# EAGLE design Escorna_CPU_2_40Amt (EAGLE 6.5.0)
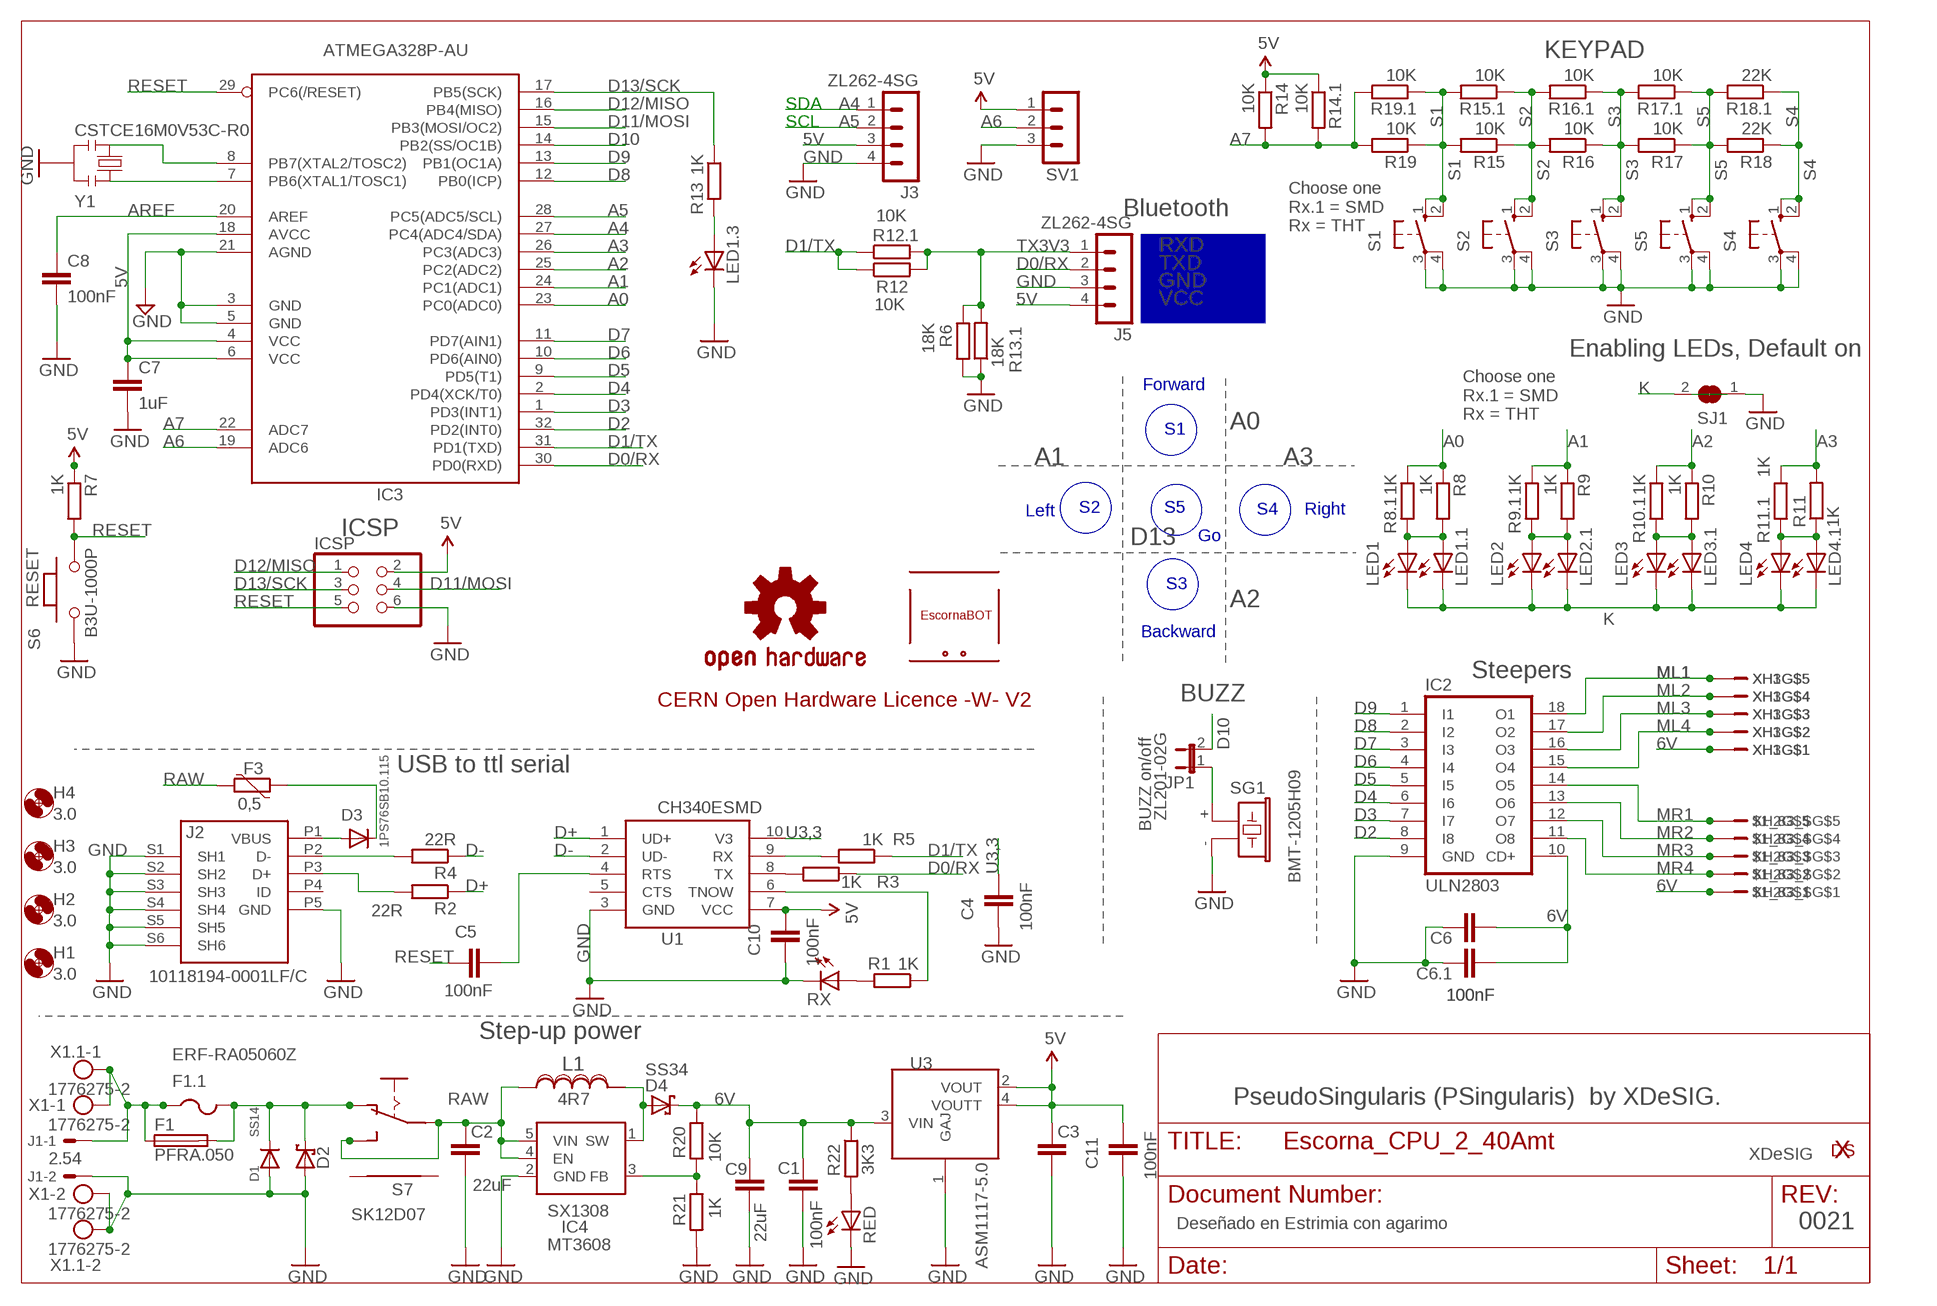
[diagram p0: schematic, sheet 1]

## Parts
$1_82_$  XDESIG_XDESIG21  [XDESIG_XDESIG]
$1_83_$  B5B-XH-A  [B5B-XH-A]
C1  100nF  0015_100NF_0603  [C0603-ROUND]
C2  22uF  C-EUC1206K  [C1206K]
C3  10uF  C-EUC1206K  [C1206K]
C4  100nF  0015_100NF_0603  [C0603-ROUND]
C5  100nF  0015_100NF_0603  [C0603-ROUND]
C6  100nF  C-EU025-024X044  [C025-024X044]
C6.1  100nF  C-EUC0603K  [C0603K]
C7  1uF  0006_1UF_0603/GRM188R61E105KA12D  [C0603-ROUND]
C8  100nF  0015_100NF_0603  [C0603-ROUND]
C9  22uF  C-EUC1206K  [C1206K]
C10  100nF  0015_100NF_0603  [C0603-ROUND]
C11  100nF  0015_100NF_0603  [C0603-ROUND]
D1  SS14  DIODESMA  [SMADIODE]
D2  1N5817  P4KEXX  [DO41-10]
D3  1PS76SB10.115  DIODESOD-323F  [SOD-323F]
D4  SS34  DIODE_SCHOTTKY-DIODESMA  [DIODE_SMA]
ESC  ESCORNABOT  [ESCORNA_PEQUE]
F1  PFRA.050  FUSETE5  [TE5]
F1.1  ERF-RA05060Z  PTCFUSE-1206  [R1206]
F3  0,5  PTC1206L  [R1206]
H1  3.0  MOUNT-HOLE3.0  [3,0]
H2  3.0  MOUNT-HOLE3.0  [3,0]
H3  3.0  MOUNT-HOLE3.0  [3,0]
H4  3.0  MOUNT-HOLE3.0  [3,0]
IC2  ULN2803  ULN2803A  [DIL18]
IC3  ATMEGA328P-AU  0265_ATMEGA328P-AU  [TQFP32-08]
IC4  SX1308  [SOT23-6]
ICSP  0114_PH254-203DF118A00V  [2X03]
J1  2.54  22-27-2021-02  [6410-02]
J2  10118194-0001LF/C  SMARTPRJ_MYCON2_USB-MINI-B  [SMARTPRJ_CON2_USB_MICRO_B_AT]
J3  ZL262-4SG  MA04-1  [MA04-1]
J5  ZL262-4SG  MA04-1  [MA04-1]
JP1  ZL201-02G  JP1E  [JP1]
L1  4R7  SRN6045-330M6045  [SRN6045]
LED1  LED3MM  [LED3MM]
LED1.1  LEDCHIPLED_0603  [CHIPLED_0603]
LED1.3  LEDCHIPLED_0603  [CHIPLED_0603]
LED2  LED3MM  [LED3MM]
LED2.1  LEDCHIPLED_0603  [CHIPLED_0603]
LED3  LED3MM  [LED3MM]
LED3.1  LEDCHIPLED_0603  [CHIPLED_0603]
LED4  LED3MM  [LED3MM]
LED4.1  LEDCHIPLED_0603  [CHIPLED_0603]
LOGO2  OSHW-LOGOL  [ESCORNA_LBRESCORNA_CPU_2_10_SPARKFUN-AESTHETICS_OSHW-LOGO-L]
R1  1K  R-EU_R0603  [R0603]
R2  22R  R-EU_R0603  [R0603]
R3  1K  R-EU_R0603  [R0603]
R4  22R  R-EU_R0603  [R0603]
R5  1K  R-EU_R0603  [R0603]
R6  18K  R-EU_0204/7  [0204/7]
R7  1K  R-EU_R0603  [R0603]
R8  1K  R-EU_0204/7  [0204/7]
R8.1  1K  R-EU_R0603  [R0603]
R9  1K  R-EU_0204/7  [0204/7]
R9.1  1K  R-EU_R0603  [R0603]
R10  1K  R-EU_0204/7  [0204/7]
R10.1  1K  R-EU_R0603  [R0603]
R11  1K  R-EU_0204/7  [0204/7]
R11.1  1K  R-EU_R0603  [R0603]
R12  10K  R-EU_0204/7  [0204/7]
R12.1  10K  R-EU_R0603  [R0603]
R13  1K  R-EU_R0603  [R0603]
R13.1  18K  R-EU_R0603  [R0603]
R14  10K  R-EU_0204/7  [0204/7]
R14.1  10K  R-EU_R0603  [R0603]
R15  10K  R-EU_0204/7  [0204/7]
R15.1  10K  R-EU_R0603  [R0603]
R16  10K  R-EU_0204/7  [0204/7]
R16.1  10K  R-EU_R0603  [R0603]
R17  10K  R-EU_0204/7  [0204/7]
R17.1  10K  R-EU_R0603  [R0603]
R18  22K  R-EU_0204/7  [0204/7]
R18.1  22K  R-EU_R0603  [R0603]
R19  10K  R-EU_0204/7  [0204/7]
R19.1  10K  R-EU_R0603  [R0603]
R20  10K  R-EU_R0603  [R0603]
R21  1K  R-EU_R0603  [R0603]
R22  3K3  R-EU_R0603  [R0603]
RED  LEDCHIPLED_0603  [CHIPLED_0603]
RX  LEDCHIPLED_0603  [CHIPLED_0603]
S1  40-XX  [B3F-40]
S2  40-XX  [B3F-40]
S3  40-XX  [B3F-40]
S4  40-XX  [B3F-40]
S5  40-XX  [B3F-40]
S6  B3U-1000P  0173_IT-1185AP1C-160G-G_T&R  [SMD_157SW]
S7  SK12D07  ESCORNA_SK12F14D  [ESCORNA_SK-12D07]
SG1  BMT-1205H09  F/CM12P  [F/CM12P]
SJ1  SJ  [SJ]
SV1  MA03-1  [MA03-1]
U1  CH340ESMD  [MSOP10]
U3  ASM1117-5.0  ASM1117-3.3  [SOT223]
X1  1776275-2  AK550/2  [AK550/2]
X1.1  1776275-2  AK550/2  [AK550/2]
XH1  B5B-XH-A  [B5B-XH-A]
XH2  B5B-XH-A  [B5B-XH-A]
XH3  B5B-XH-A  [B5B-XH-A]
Y1  CSTCE16M0V53C-R0  0011_CSTCE16M0V53-R0  [RESONATOR]

## Nets
5V: C3.2 C7.1 C10.2 C11.2 IC3.4(VCC) IC3.6(VCC) IC3.18(AVCC) ICSP.2 J3.3 J5.4 R7.1 R14.1 R14.1.1 SV1.1 U1.7(VCC) U3.2(VOUT) U3.4(VOUTT)
6V: $1_83_$.P$1 C1.2 C6.1.2 C6.2 C9.2 D4.C IC2.10(CD+) R20.1 R22.1 U3.3(VIN) XH1.P$1 XH2.P$1 XH3.P$1
+D: J2.P3(D+) R2.2
-D: J2.P2(D-) R4.2
A0: IC3.23(PC0(ADC0)) R8.1 R8.1.1
A1: IC3.24(PC1(ADC1)) R9.1 R9.1.1
A2: IC3.25(PC2(ADC2)) R10.1 R10.1.1
A3: IC3.26(PC3(ADC3)) R11.1.1 R11.2
A4: IC3.27(PC4(ADC4/SDA)) J3.1
A5: IC3.28(PC5(ADC5/SCL)) J3.2
A6: IC3.19(ADC6) SV1.2
A7: IC3.22(ADC7) R14.1.2 R14.2 R19.1.2 R19.2
AREF [aref]: C8.1 IC3.20(AREF)
D0/RX: IC3.30(PD0(RXD)) J5.2 R3.1
D1/TX: IC3.31(PD1(TXD)) R5.1 R12.1 R12.1.1
D2: IC2.8(I8) IC3.32(PD2(INT0))
D3: IC2.7(I7) IC3.1(PD3(INT1))
D4: IC2.6(I6) IC3.2(PD4(XCK/T0))
D5: IC2.5(I5) IC3.9(PD5(T1))
D6: IC2.4(I4) IC3.10(PD6(AIN0))
D7: IC2.3(I3) IC3.11(PD7(AIN1))
D8: IC2.2(I2) IC3.12(PB0(ICP))
D9: IC2.1(I1) IC3.13(PB1(OC1A))
D10: IC3.14(PB2(SS/OC1B)) JP1.2
D11/MOSI: IC3.15(PB3(MOSI/OC2)) ICSP.4
D12/MISO: IC3.16(PB4(MISO)) ICSP.1
D13/SCK: IC3.17(PB5(SCK)) ICSP.3 R13.1
D+: R2.1 U1.1(UD+)
D-: R4.1 U1.2(UD-)
DTR?: C5.2 U1.4(RTS)
GND: C1.1 C2.1 C3.1 C4.1 C6.1 C6.1.1 C7.2 C8.2 C9.1 C10.1 C11.1 D1.A D2.A IC2.9(GND) IC3.3(GND) IC3.5(GND) IC3.21(AGND) IC4.2(GND) ICSP.6 J1.2 J2.P5(GND) J2.S1(SH1) J2.S2(SH2) J2.S3(SH3) J2.S4(SH4) J2.S5(SH5) J2.S6(SH6) J3.4 J5.3 LED1.3.C R6.2 R13.1.1 R21.2 RED.C RX.C S1.3(P) S1.4(P1) S2.3(P) S2.4(P1) S3.3(P) S3.4(P1) S4.3(P) S4.4(P1) S5.3(P) S5.4(P1) S6.1 SG1.- SJ1.1 SV1.3 U1.3(GND) U3.1(GAJ) X1.1.2 X1.2 Y1.2
K: LED1.1.C LED1.K(C) LED2.1.C LED2.K(C) LED3.1.C LED3.K(C) LED4.1.C LED4.K(C) SJ1.2
ML1: IC2.18(O1) XH1.P$5 XH3.P$5
ML2: IC2.17(O2) XH1.P$4 XH3.P$4
ML3: IC2.16(O3) XH1.P$3 XH3.P$3
ML4: IC2.15(O4) XH1.P$2 XH3.P$2
MR1: $1_83_$.P$5 IC2.14(O5) XH2.P$5
MR2: $1_83_$.P$4 IC2.13(O6) XH2.P$4
MR3: $1_83_$.P$3 IC2.12(O7) XH2.P$3
MR4: $1_83_$.P$2 IC2.11(O8) XH2.P$2
N$2: JP1.1 SG1.+
N$3: D1.C D2.C F1.1.2 F1.2 S7.P$2(O)
N$4: LED2.1.A LED2.A R9.1.2 R9.2
N$5: LED1.1.A LED1.A R8.1.2 R8.2
N$6: LED3.1.A LED3.A R10.1.2 R10.2
N$8: LED4.1.A LED4.A R11.1 R11.1.2
N$10: D3.A J2.P1(VBUS)
N$12: F1.1 F1.1.1 J1.1 X1.1 X1.1.1
N$15: R1.2 RX.A
N$16: IC4.3(FB) R20.2 R21.1
N$17: IC3.7(PB6(XTAL1/TOSC1)) Y1.1
N$18: IC3.8(PB7(XTAL2/TOSC2)) Y1.3
N$19: LED1.3.A R13.2
N$20: D4.A IC4.1(SW) L1.1
N$21: D3.C F3.1
N$22: R22.2 RED.A
N$23: R5.2 U1.9(RX)
N$24: R3.2 U1.8(TX)
N$25: R1.1 U1.6(TNOW)
RAW: C2.2 F3.2 IC4.4(EN) IC4.5(VIN) L1.2 S7.P$1(P) S7.P$3(S)
RESET: C5.1 IC3.29(PC6(/RESET)) ICSP.5 R7.2 S6.2
S1: R15.1.2 R15.2 R19.1 R19.1.1 S1.1(S) S1.2(S1)
S2: R15.1 R15.1.1 R16.1.2 R16.2 S2.1(S) S2.2(S1)
S3: R16.1 R16.1.1 R17.1.2 R17.2 S3.1(S) S3.2(S1)
S4: R18.1 R18.1.1 S4.1(S) S4.2(S1)
S5: R17.1 R17.1.1 R18.1.2 R18.2 S5.1(S) S5.2(S1)
TX3V3: J5.1 R6.1 R12.1.2 R12.2 R13.1.2
U3,3: C4.2 U1.10(V3)
Unconnected: J2.P4(ID) S7.P$4 S7.P$5 U1.5(CTS)

## Notes on the sheet
- KEYPAD
- SDA
- SCL
- Bluetooth
- Choose one
  Rx.1 = SMD
  Rx = THT
- RXD
- TXD
- GND
- VCC
- Enabling LEDs, Default on
- Forward
- A0
- S1
- Choose one
  Rx.1 = SMD
  Rx = THT
- A1 | A3
- Left | S2 | S5 | S4 | Right
- ICSP
- D13 | Go
- S3
- RESET | A2
- Backward
- BUZZ | Steepers
- CERN Open Hardware Licence -W- V2
- BUZZ on/off
- USB to ttl serial
- Step-up power
- PseudoSingularis (PSingularis)  by XDeSIG.
- XDeSIG
- SX1308
- IC4 | Deseñado en Estrimia con agarimo | 0021
- MT3608

## Library data of the parts
$1_82_$ = Escorna_CPU_2_01:XDESIG_XDESIG
$1_83_$ XH1-XH3 = con-jst:B5B-XH-A
C1 C4 C5 C8 C10 C11 = Condensatori:0015_100NF_0603: 100nF 0603 50V; CASE: 0603; MONTHLY_USAGE: _____; PART_NUMBER: cl10b104kbnc; PRICE: _____; SUPPLIER: _____; TYPE: Condensatori
C2 C3 C6 C6.1 C9 = rcl:C-EU: CAPACITOR, European symbol
C7 = Condensatori:0006_1UF_0603/GRM188R61E105KA12D: 1uF 0603; CASE: 0603; MONTHLY_USAGE: _____; PART_NUMBER: 1uF_0603/GRM188R61E105KA12D; PRICE: _____; SUPPLIER: _____; TYPE: Condensatori
D1 D3 = adafruit:DIODE: Diode SMADIODE - SMA Surface Mount Package 20V 1A Schottky Diode Digikey: 641-1014-6-ND DO-1N4148 - Through Hole Small Current Diode SOD-123 20V 1 A (.5mV Vf) Schottky Diode - Digikey: MBRX120TPMSCT-ND SOD-323 10V 570mA (.38mV Vf, 3ns) Schottky Diode - Digikey: ZLLS410CT-ND SOD-523 30V 30mA Schottky Diode (RB751S-40TE61) - Digikey: RB751S-40TE61CT-ND SOT23-R/W - SOT23 Package (R = Solder Paste/Reflow Ovens, W = Hand-Soldering) BAT54Film 40V 300mA - Digikey: 497-7162-1-ND
D2 = diode:P4KEXX: DIODE transient-voltage suppressor
D4 = cervus2.100:DIODE_SCHOTTKY-DIODE: Schottky Diode
ESC = escorna:ESCORNABOT
F1 = fuse:FUSE: Fuse; OC_FARNELL: unknown; OC_NEWARK: unknown
F1.1 = adafruit:PTCFUSE: PTC fuses, resettable thermistors
F3 = Arduino-rcl:PTC: SMD PTC
H1-H4 = holes:MOUNT-HOLE: MOUNTING HOLE with drill center marker
IC2 = uln-udn:ULN2803A: DRIVER ARRAY
IC3 = IntegratedCircuits:0265_ATMEGA328P-AU: 8-bit Microcontroller with 32KBytes In-System Programmable Flash ATMEGA328P-AU; CASE: TQFP32_7x7; MONTHLY_USAGE: _____; PART_NUMBER: ATMEGA328P-AU; PRICE: _____; SUPPLIER: _____; TYPE: Circuito_Integrato
IC4 = SX1308:SX1308
ICSP = Connettori:0114_PH254-203DF118A00V: 3x2 M V h 8,5 mm p2,54; MONTHLY_USAGE: _____; PART_NUMBER: PH254-203DF118A00V; PRICE: _____; SUPPLIER: _____; TYPE: Connettori; VALUE: ICSP
J1 = con-molex:22-?-02: CONNECTOR wire to board 2.54 mm (.1 inch) pitch header; OC_FARNELL: unknown; OC_NEWARK: unknown
J2 = cervus2.100:SMARTPRJ_MYCON2_USB-MINI-B
J3 J5 = con-lstb:MA04-1: PIN HEADER; OC_FARNELL: unknown; OC_NEWARK: unknown
JP1 = jumper:JP1E: JUMPER
L1 = SRN6045-330M:SRN6045-330M: Fixed Inductors SMD; AVAILABILITY: Unavailable; DESCRIPTION: 33µH Semi-Shielded Wirewound Inductor 1.4A 188mOhm Max Nonstandard; MF: Bourns; MP: SRN6045-330M; PACKAGE: Nonstandard Bourns; PRICE: None
LED1 LED1.1 LED1.3 LED2 LED2.1 LED3 LED3.1 LED4 LED4.1 RED RX = adafruit:LED: LED OSRAM: - CHIPLED LG R971, LG N971, LY N971, LG Q971, LY Q971, LO R971, LY R971 LH N974, LH R974 LS Q976, LO Q976, LY Q976 LO Q996 - Hyper CHIPLED LW Q18S LB Q993, LB Q99A, LB R99A - SideLED LS A670, LO A670, LY A670, LG A670, LP A670 LB A673, LV A673, LT A673, LW A673 LH A674 LY A675 LS A676, LA A676, LO A676, LY A676, LW A676 LS A679, LY A679, LG A679 - Hyper Micro SIDELED® LS Y876, LA Y876, LO Y876, LY Y876 LT Y87S - SmartLED LW L88C, LW L88S LB L89C, LB L89S, LG L890 LS L89K, LO L89K, LY L89K LS L896, LA L896, LO L896, LY L896 - TOPLED LS T670, LO T670, LY T670, LG T670, LP T670 LSG T670, LSP T670, LSY T670, LOP T670, LYG T670 LG T671, LOG T671, LSG T671 LB T673, LV T673, LT T673, LW T673 LH T674 LS T676, LA T676, LO T676, LY T676, LB T676, LH T676, LSB T676, LW T676 LB T67C, LV T67C, LT T67C, LS T67K, LO T67K, LY T67K, LW E67C LS E67B, LA E67B, LO E67B, LY E67B, LB E67C, LV E67C, LT E67C LW T67C LS T679, LY T679, LG T679 LS T770, LO T770, LY T770, LG T770, LP T770 LB T773, LV T773, LT T773, LW T773 LH T774 LS E675, LA E675, LY E675, LS T675 LS T776, LA T776, LO T776, LY T776, LB T776 LHGB T686 LT T68C, LB T68C - Hyper Mini TOPLED® LB M676 - Mini TOPLED Santana® LG M470 LS M47K, LO M47K, LY M47K Source: http://www.osram.convergy.de/
LOGO2 = Echidna_shield_LBR:OSHW-LOGO: Open Source Hardware Logo This logo indicates the piece of hardware it is found on incorporates a OSHW license and/or adheres to the definition of open source hardware found here: http://freedomdefined.org/OSHW
R1-R8 R8.1 R9 R9.1 R10 R10.1 R11 R11.1 R12 R12.1 R13 R13.1 R14 R14.1 R15 R15.1 R16 R16.1 R17 R17.1 R18 R18.1 R19 R19.1 R20-R22 = rcl:R-EU_: RESISTOR, European symbol
S1-S5 = switch-omron:40-XX: OMRON SWITCH; MF: OMRON COMPONENTS USA; MPN: B3F-4000; OC_FARNELL: 176434; OC_NEWARK: 36K3105
S6 = Switches:0173_IT-1185AP1C-160G-G_T&R: Pushbutton 4x3 SMD H2,5mm; MONTHLY_USAGE: _____; PART_NUMBER: IT-1185AP1C-160G-G_T&R; PRICE: _____; SUPPLIER: _____; TYPE: Switches; VALUE: 157SW
S7 = escorna_ELIB:ESCORNA_SK12F14
SG1 = buzzer:F/CM12P: BUZZER Source: Buerklin; OC_FARNELL: unknown; OC_NEWARK: unknown
SJ1 = jumper:SJ: SMD solder JUMPER
SV1 = con-lstb:MA03-1: PIN HEADER; OC_FARNELL: unknown; OC_NEWARK: unknown
U1 = CH340E:CH340E: WCH.CN/CH340E See DataSheet： wch.cn <http://www.wch.cn/downloads/CH340DS1_PDF.html>; AVAILABILITY: Unavailable; DESCRIPTION: USB to serial chip CH340; MF: WCH; MP: CH340E; PACKAGE: Package Analog Devices; PRICE: None
U3 = Itead_IC_110429:ASM1117-3.3: ICP006
X1 X1.1 = con-ptr500:AK550/2: CONNECTOR; OC_FARNELL: unknown; OC_NEWARK: unknown
Y1 = Cristalli:0011_CSTCE16M0V53-R0: 16Mhz - SMD; MONTHLY_USAGE: _____; PART_NUMBER: CSTCE16M0V53-R0; PRICE: _____; SUPPLIER: _____; TYPE: Cristalli; VALUE: CSTCE16M0V53-R0

## Net classes
0 default: width 0.254 mm, drill 0.61 mm, clearance 0.254 mm
1 power: width 0.254 mm, drill 0.61 mm, clearance 0.254 mm
4 aref: width 0.254 mm, drill 0.61 mm, clearance 0.254 mm

## Board
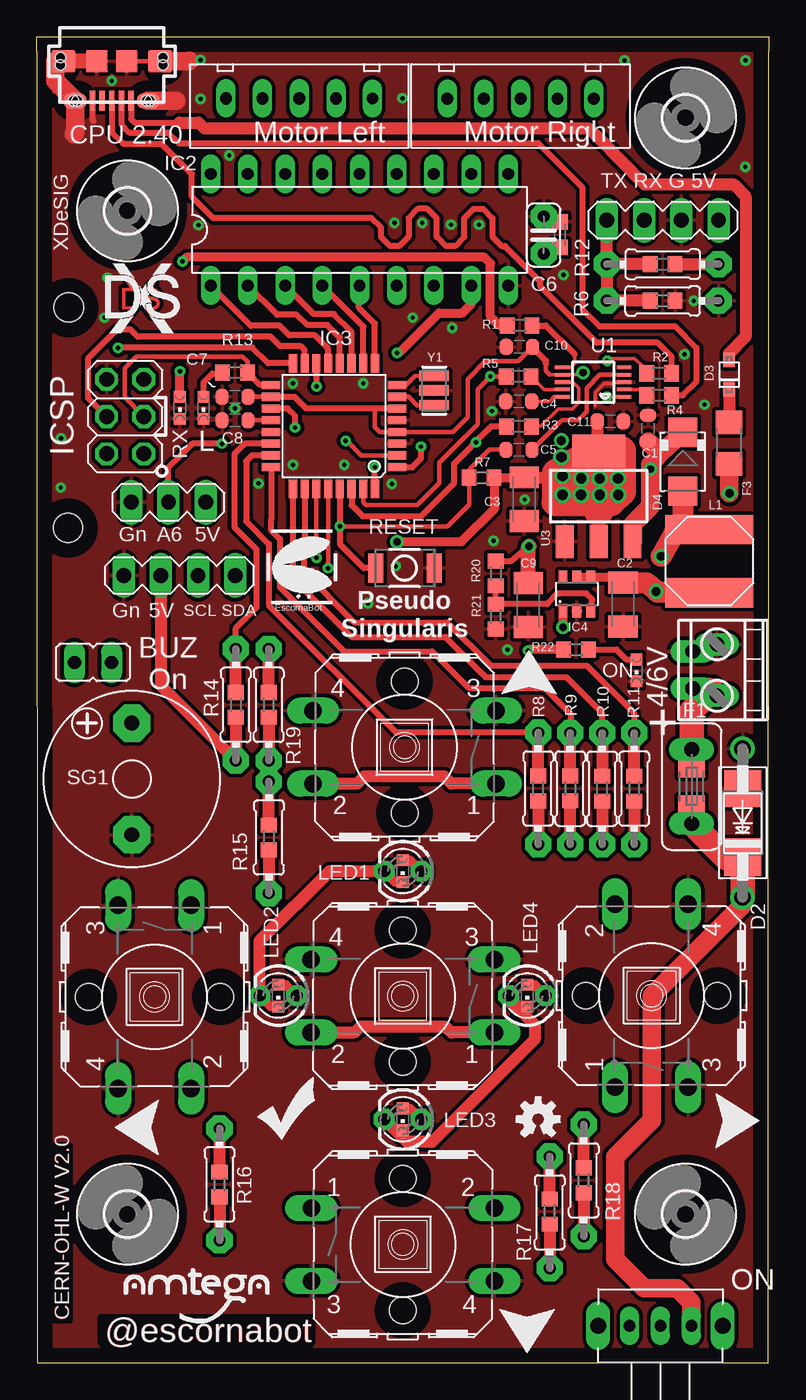
[diagram p1: board, top side]
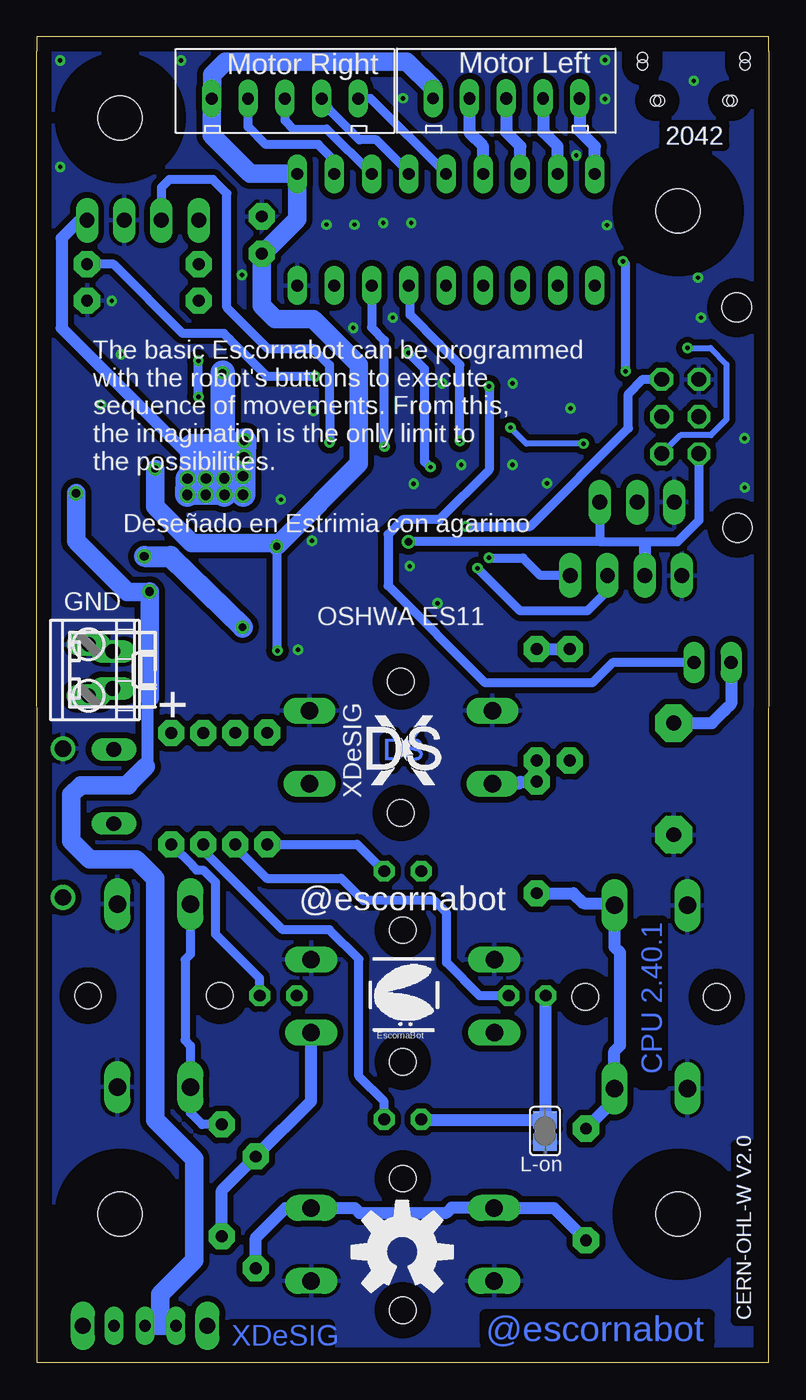
[diagram p2: board, bottom side, seen from below]

Size 49.99 x 90.58 mm. Coordinates in mm from the lower left corner, seen from the top.
Outline: 49.99,89.59 49.95,0 0.05,0 0,89.59
Outline: 0,89.58 0,89.59
Outline: 0,89.59 0,90.58 49.99,90.57 49.99,89.59
Copper layers (1*16): Top 0.035mm / dielectric 1.5mm / Bottom 0.035mm
Design rules "PCBway": minimum track width 6mil, minimum drill 0.3mm, track to track 0.205mm, track to pad 0.205mm, pad to pad 0.205mm, via to via 0.205mm, smd to smd 8mil, copper to edge 40mil, drill to drill 8mil, minimum pad ring 10mil, minimum via ring 8mil, stop-mask expansion 4mil, vias tented up to drill 25mil, thermal gap 10mil
Holes 2 mm at 2.15,57.03 2.2,72.08

### Footprints (pad centres in the part's own frame; a part is rotated, then mirrored left to right if it is on the bottom)
B5B-XH-A = drill 0.8 long: P$1 -5.17,-0.19; P$2 -2.69,-0.175; P$3 -0.175,-0.175; P$4 2.34,-0.175; P$5 4.83,-0.175
C0603-ROUND = smd 0.898 x 1.1: 1 -0.889,0; 2 0.889,0
C1206K = smd 1.5 x 2: 1 -1.5,0; 2 1.5,0
C025-024X044 = drill 0.813 pad 1.778 octagon: 1 -1.27,0; 2 1.27,0
C0603K = smd 1.05 x 1.08: 1 -0.875,0; 2 0.875,0
SMADIODE = smd 2.54 x 2.54: A 2.349,0; C -2.349,0
DO41-10 = drill 1.118: A 5.08,0; C -5.08,0
SOD-323F = smd 1 x 0.8: A -1,0; C 1,0
DIODE_SMA = smd 2 x 2: A 2,0; C -2,0
TE5 = drill 1.016 long: 1 -2.54,0; 2 2.54,0
R1206 = smd 1.6 x 1.803: 1 -1.422,0; 2 1.422,0
3,0 = hole 3: 0,0
DIL18 = drill 0.813 long: 1 -10.16,-3.81; 2 -7.62,-3.81; 3 -5.08,-3.81; 4 -2.54,-3.81; 5 0,-3.81; 6 2.54,-3.81; 7 5.08,-3.81; 8 7.62,-3.81; 9 10.16,-3.81; 10 10.16,3.81; 11 7.62,3.81; 12 5.08,3.81; 13 2.54,3.81; 14 0,3.81; 15 -2.54,3.81; 16 -5.08,3.81; 17 -7.62,3.81; 18 -10.16,3.81
TQFP32-08 = smd 1.27 x 0.559: 1 -4.293,2.8; 2 -4.293,2; 3 -4.293,1.2; 4 -4.293,0.4; 5 -4.293,-0.4; 6 -4.293,-1.2; 7 -4.293,-2; 8 -4.293,-2.8; 17 4.293,-2.8; 18 4.293,-2; 19 4.293,-1.2; 20 4.293,-0.4; 21 4.293,0.4; 22 4.293,1.2; 23 4.293,2; 24 4.293,2.8 | smd 0.559 x 1.27: 9 -2.8,-4.293; 10 -2,-4.293; 11 -1.2,-4.293; 12 -0.4,-4.293; 13 0.4,-4.293; 14 1.2,-4.293; 15 2,-4.293; 16 2.8,-4.293; 25 2.8,4.293; 26 2,4.293; 27 1.2,4.293; 28 0.4,4.293; 29 -0.4,4.293; 30 -1.2,4.293; 31 -2,4.293; 32 -2.8,4.293
SOT23-6 = smd 0.6 x 0.9: 1 -0.95,-1.15; 2 0,-1.15; 3 0.95,-1.15; 4 0.95,1.15; 5 0,1.15; 6 -0.95,1.15
2X03 = drill 1.016 pad 1.55 octagon: 1 -2.54,-1.27; 2 -2.54,1.27; 3 0,-1.27; 4 0,1.27; 5 2.54,-1.27; 6 2.54,1.27
6410-02 = drill 1.016 long: 1 1.27,0; 2 -1.27,0
SMARTPRJ_CON2_USB_MICRO_B_AT = smd 0.406 x 1.346: P1 -1.321,2.692; P2 -0.66,2.692; P3 0,2.692; P4 0.66,2.692; P5 1.321,2.692 | smd 1.651 x 1.549: S1 -3.302,0; S2 3.302,0 | smd 1.524 x 1.016: S3 -2.489,2.692; S4 2.489,2.692 | smd 1.524 x 1.524: S5 -1.016,0; S6 1.016,0 | hole 0.7: -3.505,0.254; -3.505,-0.254; 3.505,0.254; 3.505,-0.254; -2.616,2.692; -2.362,2.692; 2.362,2.692; 2.616,2.692
MA04-1 = drill 1.016 long: 1 -3.81,0; 2 -1.27,0; 3 1.27,0; 4 3.81,0
JP1 = drill 0.914 long: 1 0,-1.27; 2 0,1.27
SRN6045 = smd 2.007 x 5.994: 1 -2.159,0; 2 2.159,0
LED3MM = drill 0.813 pad 1.422 octagon: A -1.27,0; K 1.27,0
CHIPLED_0603 = smd 0.8 x 0.8: A 0,-0.75; C 0,0.75
R0603 = smd 1 x 1.1: 1 -0.85,0; 2 0.85,0
0204/7 = drill 0.813 pad 1.778 octagon: 1 -3.81,0; 2 3.81,0
B3F-40 = drill 1.194 pad 1.27 long: 1 -6.248,2.489; 2 6.248,2.489; 3 -6.248,-2.489; 4 6.248,-2.489 | hole 1.803: 0,-4.496; 0,4.496
SMD_157SW = smd 1.016 x 1.981: 1 0,0; 2 4,0
ESCORNA_SK-12D07 = drill 0.8 long: P$1 0,0; P$2 2.115,0; P$3 -2.115,0 | drill 1.1 pad 1.27 long: P$4 -4.25,0; P$5 4.25,0
F/CM12P = drill 1.016 pad 2.54 octagon: + 3.81,0; - -3.81,0
SJ = smd 1.168 x 1.6: 1 -0.762,0; 2 0.762,0
MA03-1 = drill 1.016 long: 1 -2.54,0; 2 0,0; 3 2.54,0
MSOP10 = smd 1 x 0.25: 1 -2.113,1; 2 -2.113,0.5; 3 -2.113,0; 4 -2.113,-0.5; 5 -2.113,-1; 6 2.113,-1; 7 2.113,-0.5; 8 2.113,0; 9 2.113,0.5; 10 2.113,1
SOT223 = smd 1.219 x 2.235: 1 -2.311,-3.099; 2 0,-3.099; 3 2.311,-3.099 | smd 3.6 x 2.2: 4 0,3.099
AK550/2 = drill 1 pad 1.5 long: 1 -1.75,0; 2 1.75,0
RESONATOR = smd 0.7 x 2: 1 -1,0; 2 0,0; 3 1,0

### Placement (x,y rotation side)
$1_82_$  27.45,39.49 0 bottom
$1_83_$  32.87,86.17 180 top
C1  41.75,63.83 270 top
C2  40.03,51.8 90 top
C3  33.29,58.98 90 top
C4  32.92,65.67 0 top
C5  32.93,62.36 0 top
C6  34.61,77.03 270 top
C6.1  35.72,77.05 270 top
C7  13.55,65.98 180 top
C8  13.55,64.38 180 top
C9  33.57,51.77 90 top
C10  32.96,69.38 0 top
C11  39.16,64.3 180 top
D1  48.2,36.88 90 top
D2  48.2,36.87 90 top
D3  47.27,67.49 270 top
D4  44.11,61.54 270 top
ESC  27.39,22.56 0 bottom
F1  44.72,39.37 270 top
F1.1  44.72,39.36 270 top
F3  47.28,62.82 270 top
H1  6.2,78.68 0 top
H2  44.3,85.03 0 top
H3  44.3,10.16 90 top
H4  6.2,10.16 90 top
IC2  22.04,77.39 0 top
IC3  20.3,63.98 180 top
IC4  36.88,52.51 0 top
ICSP  6.05,64.63 90 top
J1  44.8,47.33 270 bottom
J2  5.13,88.89 180 top
J3  9.75,53.78 180 top
J5  42.74,78.04 0 top
JP1  3.85,47.83 270 top
L1  45.93,54.75 270 top
LED1  25,33.58 180 top
LED1.1  25,33.58 180 top
LED1.3  11.4,65.23 180 top
LED2  16.5,25.08 180 top
LED2.1  16.5,25.08 180 top
LED3  25,16.63 180 top
LED3.1  25,16.63 180 top
LED4  33.5,25.08 180 top
LED4.1  33.5,25.08 180 top
LOGO1  OSHW-LOGOS  [OSHW-LOGO-S]  34.23,16.64 0 top
LOGO2  25.03,7.59 0 bottom
R1  32.98,70.85 180 top
R2  42.5,67.58 0 top
R3  32.93,63.95 0 top
R4  42.5,66.08 0 top
R5  32.91,67.36 0 top
R6  42.74,72.54 0 top
R7  30.38,60.45 180 top
R8  34.24,39.23 270 top
R8.1  34.24,39.23 270 top
R9  36.43,39.22 270 top
R9.1  36.43,39.23 270 top
R10  38.61,39.22 270 top
R10.1  38.61,39.21 270 top
R11  40.8,39.22 90 top
R11.1  40.8,39.22 270 top
R12  42.74,75.04 180 top
R12.1  42.74,75.04 180 top
R13  13.55,67.63 180 top
R13.1  42.74,72.54 180 top
R14  13.6,44.94 90 top
R14.1  13.6,44.94 90 top
R15  15.86,35.89 90 top
R15.1  15.86,35.88 90 top
R16  12.49,12.19 90 top
R16.1  12.49,12.19 90 top
R17  35.02,10.28 270 top
R17.1  35.02,10.33 270 top
R18  37.35,12.47 270 top
R18.1  37.35,12.47 270 top
R19  15.85,44.94 90 top
R19.1  15.85,44.94 90 top
R20  31.35,53.92 270 top
R21  31.34,50.97 270 top
R22  36.83,48.71 0 top
RED  40.95,47.3 180 top
RX  9.78,65.23 180 top
S1  25.12,42.05 180 top
S2  8.05,25 270 top
S3  25,8.09 0 top
S4  41.99,25.08 90 top
S5  25,25.06 180 top
S6  27.15,54.28 180 top
S7  42.59,2.53 0 top
SG1  6.5,39.88 90 top
SJ1  15.28,15.83 90 bottom
SV1  9,58.78 180 top
U1  38,66.98 180 top
U3  38.38,59.2 0 top
U$1  [AMTEGA]  5.95,2.73 0 top
U$4  FRECHA  [FRECHA]  31.56,3.69 270 top
U$5  ESCORNABOT  [ESCORNA_PEQUE]  15.65,51.77 0 top
U$7  FRECHA  [FRECHA]  46.31,14.61 0 top
U$8  FRECHA  [FRECHA]  35.54,45.65 90 top
U$9  FRECHA  [FRECHA]  8.36,18.01 180 top
U$10  GO  [VALE]  15.01,15.21 0 top
U$12  XDESIG_XDESIG21  [XDESIG_XDESIG]  4.69,70.34 0 top
X1  46.44,47.32 90 bottom
X1.1  46.44,47.32 90 top
XDS  XDESIG  [XDESIG_CU_2]  5.87,71.44 0 top
XDS1  XDESIG  [XDESIG_CU_2]  26.17,40.65 0 bottom
XH1  17.76,86.55 0 bottom
XH2  32.87,86.53 0 bottom
XH3  17.76,86.17 180 top
Y1  27.13,66.41 90 top

### Tracks (layer width: path | path; a pad name or v marks a point on that pad's centre or on a via)
5V  (via drill 0.5, 0.6, 0.7)
  Top 0.254: 24.4,63.58 IC3.4 | 35.04,67.48 U1.7 37.15,67.48
  Top 0.305: C7.1 IC3.18 | 35.04,67.48 34.77,67.75 34.77,68.23 | 23.2,65.18 23.08,65.05 23.08,63.92 23.42,63.58 IC3.4 28.41,63.58 29.42,64.59 29.42,67.2 30.63,68.41 32.87,68.41 C10.2 | 37.15,67.48 v37.3,67.63
  Top 0.406: IC3.6 23.2,65.18 18.4,65.18 17.6,65.98 IC3.18 | 34.77,68.23 34.77,68.46 C10.2
  Top 0.61: C3.2 R7.1 31.23,58.31 29,56.08 v24.6,56.08 | U3.2 38.38,58.1 38.37,58.11
  Top 0.813: R14.1.1 R14.1 8.48,46.25 J3.3 | C11.2 38.26,62.41 U3.4 | C3.2 36.82,60.48 36.96,60.35
  Top 1.93: 38.37,58.11 38.37,62.29 U3.4 37.32,61.88 35.47,60.76 35.47,58.79 35.45,58.78 39.21,58.78 39.94,59.51 39.94,62.29 39.59,62.35 39.04,62.38 v37.19,60.41 36.96,60.35
  Bottom 0.305: v37.19,60.41 37.28,60.01 38.31,60.69 v38.44,59.29
  Bottom 0.61: 8.5,56.08 8.48,56.06 8.48,56.05 8.44,56.01 | 11.5,56.08 v24.6,56.08 | SV1.1 11.54,56.12 11.5,56.08 | 11.5,56.08 8.36,56.08 | 8.48,55.96 8.44,56.01 | 8.44,56.01 8.36,56.08 | 8.36,56.08 6.23,56.08 4.78,57.53 ICSP.2
  Bottom 0.813: J5.4 47.06,78.04 48.29,76.8 48.29,70.68 39.37,61.76 | 8.48,55.96 J3.3
  Bottom 1.676: v35.83,63 v35.84,61.87 v35.9,60.56 | v35.9,60.56 v35.9,59.29 | v37.17,59.29 37.17,59.43 | 37.17,59.43 36.83,59.77 | v38.44,60.39 39.6,59.44 37.17,59.43 | v39.69,60.4 v39.71,59.29 | v35.9,60.56 v37.19,60.41 | v37.19,60.41 36.28,62.64 39.37,62.63 39.37,61.76 39.37,61.22 v39.71,59.29 | v39.71,59.29 v38.44,60.39 | v38.44,60.39 v37.19,60.41 | v37.3,67.63 37.3,62.35 38.19,61.45 38.19,60.84 v38.44,60.39
6V  (via drill 0.3, 0.5)
  Top 0.406: 33.55,55.9 v33.6,55.77 32.42,54.77 R20.1
  Top 0.61: C6.1.2 35.03,76.18 C6.2 | R22.1 33.61,48.71 v33.55,48.65
  Top 1.016: C1.2 41.83,62.94 | C9.2 33.57,55.73 v33.6,55.77
  Top 1.27: 42.59,62.1 41.91,61.35 v41.91,61.04 41.91,58.5 40.69,57.28 U3.3 | 42.59,62.1 D4.C | C1.2 41.83,62.86 42.59,62.1
  Bottom 0.406: XH2.P$1 $1_83_$.P$1 | 33.47,55.9 v33.6,55.77 33.62,55.97
  Bottom 0.61: v33.55,48.65 33.55,55.83 33.22,56.16
  Bottom 1.27: XH1.P$1 22.93,87.09 24.72,88.88 37.1,88.88 38,87.98 38,86.38 XH2.P$1 38.04,83.84 35.4,81.2 IC2.10 32.2,78.13 34.57,75.76 C6.2 34.61,72.19 33.7,71.28 31.1,71.28 28,68.18 28,61.43 33.22,56.16 v33.6,55.77 33.65,56 39.41,56 41.91,58.5 v41.91,61.04
+D
  Top 0.406: J2.P3 5.13,84.03 5.85,83.32 | 5.85,83.32 | 5.85,83.32 5.89,83.28 8.5,83.28 10.6,81.18 10.6,79.66 12.06,78.19 22.86,78.19 23.5,77.55 23.5,76.91 24.13,76.28 24.77,76.28 25.4,76.91 25.4,78.19 26.04,78.82 26.67,78.82 27.3,78.19 27.3,76.91 27.94,76.28 28.57,76.28 29.21,76.91 29.21,78.19 29.84,78.82 30.48,78.82 31.11,78.19 31.11,76.91 31.75,76.28 31.96,76.28 34.39,73.85 34.39,73.52 38.24,69.67 42.4,69.67 43.35,68.72 R2.2
-D
  Top 0.406: J2.P2 5.79,84.58 6.34,84.03 8.96,84.03 9.71,83.29 34.24,83.29 | 34.24,83.29 34.22,83.31 | 34.24,83.29 37.28,80.25 37.28,71.95 38.43,70.79 43.59,70.79 45.06,69.32 45.06,67.02 44.12,66.08 R4.2
A0
  Top 0.305: 24.54,43.04 16.5,51.08
  Top 0.406: IC3.23 14.7,61.98 14.3,61.58 14.3,57.48 15.85,55.93 15.85,51.73 24.54,43.04 R8.1
  Top 0.813: R8.1.1 R8.1
A1
  Top 0.406: IC3.24 16.01,57.59 16,57.58 16,56.88 16.6,56.28 16.6,52.98 21,48.58 27,48.6 29.5,46.1 34.7,46.08 36.49,44.29 R9.1
  Top 0.813: R9.1.1 R9.1
A2
  Top 0.406: IC3.25 17.5,53.58 21.5,49.58 27.9,49.58 30.4,47.08 30.41,47.08 30.65,46.84 36.17,46.84 38.61,44.4 R10.1
  Top 0.813: R10.1 R10.1.1
A3
  Top 0.406: IC3.26 18.3,55.48 18.25,55.43 18.25,54.03 21.7,50.58 28.04,50.58 31,47.63 37.55,47.63 40.8,44.38 R11.2
  Top 0.813: R11.1.1 R11.2
A4  (via drill 0.3)
  Top 0.305: IC3.27 v19.1,54.98
  Bottom 0.61: v19.1,54.98 16.8,54.98 15.6,53.78 J3.1
A5  (via drill 0.3)
  Top 0.305: IC3.28 v19.9,54.28
  Bottom 0.406: v19.9,54.28 19.85,54.43
  Bottom 0.61: 19.85,54.23 v19.9,54.28 16.97,51.35 12.41,51.35 11,52.76 11,53.76 J3.2
A6  (via drill 0.3)
  Top 0.406: v17.65,63.88 17.65,64.68 17.15,65.18 IC3.19 | SV1.2 9,61.15 9.86,62.01 10.16,62.31 10.63,62.78 v12.65,62.78
  Bottom 0.406: v12.65,62.78 16.55,62.78 v17.65,63.88
A7
  Top 0.406: IC3.22 14.2,62.78 13.5,62.08 13.5,57.08 15,55.58 15,51.58 13.6,50.18 R14.2
  Top 0.813: R19.1.2 R19.2 | R14.1.2 R14.2
  Bottom 0.813: R19.2 R14.2
AREF
  Top 0.305: C8.1 IC3.20
D0/RX  (via drill 0.3)
  Top 0.305: v29.99,62.87 29.99,62.92 30.84,63.77
  Top 0.406: IC3.30 21.5,58.58 22.25,57.83 26.25,57.83 28.5,60.08 28.5,61.43 30.84,63.77 31.03,63.95 R3.1
  Bottom 0.406: J5.2
  Bottom 0.61: v29.99,62.87 30,68.15 31.13,69.28 34.2,69.28 37,72.08 37,79.86 37.96,80.81 40.92,80.81 41.47,80.27 J5.2
D1/TX  (via drill 0.3)
  Top 0.254: R5.1
  Top 0.305: IC3.31 22.3,58.78 22.5,58.58 26,58.58 27.5,60.08 27.5,61.5 30.1,64.1 30.1,66.5 v30.97,67.37 32.05,67.37 R5.1
  Top 0.813: R12.1.1 R12.1
  Bottom 0.61: R12.1 44.74,75.04 40.02,70.31 37.21,70.31 36.83,69.93 35.23,68.33 35.23,68.31 35.22,68.31 34.29,67.39 30.99,67.39 v30.97,67.37
D2  (via drill 0.3)
  Top 0.406: IC3.32 v23.1,61.18
  Top 0.61: IC2.8 29.65,73.57 29.65,72.28 29.07,71.7 27.46,71.7 24.73,68.98 v24.6,68.98
  Bottom 0.61: v23.1,61.18 23.1,61.14 23.5,61.54 23.5,67.88 v24.6,68.98
D3  (via drill 0.3)
  Top 0.406: IC3.1 25.65,61.18 26.25,61.78 v26.25,62.58
  Bottom 0.61: v26.25,62.58 26.25,69.83 27.12,70.7 IC2.7
D4  (via drill 0.3)
  Top 0.305: v21.1,62.98 21.15,62.93 21.23,62.93 22.18,61.98 IC3.2
  Bottom 0.406: 24.5,73.5 IC2.6
  Bottom 0.61: 24.5,73.5 24.5,71.58 22.5,69.58 22.5,69.57 21.1,68.17 v21.1,62.98
D5
  Top 0.406: IC3.9 23.1,70.98 22,72.08 22,73.54 IC2.5
D6
  Top 0.406: IC3.10 22.3,70.79 IC2.4
D7
  Top 0.406: IC3.11 21.5,70.43 20.3,71.63 18.92,71.63 IC2.3
D8
  Top 0.406: IC3.12 20.7,70.03 19.85,70.88 18.5,70.88 17.75,71.58 16.43,71.58 IC2.2
D9
  Top 0.406: IC3.13 19.9,69.28 19,70.18 17.25,70.18 16.6,70.83 14.64,70.83 IC2.1
D10  (via drill 0.3)
  Top 0.406: IC3.14 v19.1,66.7
  Bottom 0.61: v19.1,66.7 19.1,60.98 22.5,57.58 25,57.58 26,56.58 26,53.08 19.36,46.43 12.06,46.43 10.67,47.83 JP1.2
D11/MOSI
  Top 0.406: ICSP.4 3.5,65.91 3.5,68.58 5,70.08 5.5,70.58 6.42,70.58 6.92,70.08 16,70.08 16.65,69.43 18.05,69.43 18.3,69.18 IC3.15
D12/MISO  (via drill 0.3)
  Top 0.406: IC3.16 15.8,68.27 14.72,69.35 5.71,69.35 v5.56,69.31
  Bottom 0.406: v5.56,69.31 3.98,69.31 2.9,68.21 2.9,64.43 3.97,63.36 6.05,63.36 ICSP.1
D13/SCK
  Top 0.305: R13.1 14.4,68.38 14.05,68.73 6.8,68.73 6,67.93 6,65.95 ICSP.3
  Top 0.406: IC3.17 15.25,66.78 R13.1
D+  (via drill 0.3)
  Top 0.254: U1.1 v38.95,65.98 | R2.1 41.3,67.93 41.3,68.13 40.95,68.48 40.95,68.49 40.84,68.6 39.12,68.6 v38.95,68.43
  Bottom 0.61: v38.95,65.98 v38.95,68.42 v38.95,68.43
D-
  Top 0.254: U1.2 41.25,66.48
  Top 0.305: 41.25,66.48 R4.1
DTR?
  Top 0.254: U1.4 39.45,67.48 | C5.2 33.9,62.43
  Top 0.305: 39.45,67.48 38.45,67.48 37.55,66.58 37.55,64.98 37.28,64.71 37.12,64.55 36.97,64.4 35.88,64.4 35.76,64.29 | 33.9,62.43 35.76,64.29 | 35.76,64.29
GND  (via drill 0.3)
  Top 0.254: U1.3 39.45,66.98 39.35,66.88 38.75,66.88 38.15,66.28 38.15,65.38
  Top 0.305: 44.36,69.07 44.3,69.13 | J2.S1 J2.S5 | J2.S6 J2.S2
  Top 0.406: J2.P5 3.81,84.89 3.87,84.83
  Top 1.016: J2.S6 1.27,88.89 1.27,88.98
  Top 1.27: 2.54,83.9 2.64,84 J2.S4 1.27,87.57 1.27,88.89 | J2.S3 9.54,86.2 | J2.S1 10.4,88.89 10.43,88.92
  other vias: 25.68,71.38 31.08,65.01 32.14,48.7 15.15,60.08 1.67,63.14 33.32,58.96 13.55,65.18 35.97,74.31 24.25,60.03 17.5,61.33 11.05,77.7 21,61.33 1.65,59.78 31.2,56.14 45.59,65.44 48.38,81.68 13.15,82.46 24.97,86.37 11.19,86.33 11.18,88.99 4.64,71.39 4.84,74.12 17.49,66.9 30.19,77.73 28.37,70.7 22.3,66.91 5.13,87.56 26.33,77.86 22.61,51.88 24.52,54.42 44.87,72.52 44.23,68.88 48.39,88.96 40.13,88.96 28.29,77.73 24.42,77.86
  pour Bottom (isolate 0.406): 0,90.08 50.35,90.18 50,0.08 0,0.08
  pour Top: -0.75,91.4 50.5,91.85 50,0.08 -1.25,-2.91
K
  Top 0.61: LED3.1.C 24.48,15.88 LED3.K | LED2.1.C 15.98,24.33 LED2.K | LED1.1.C 24.48,32.83 LED1.K | LED4.1.C 32.98,24.33 LED4.K
  Top 0.813: LED4.K 32.23,24.85 34,23.08 34,22.08 27,15.08 25.28,15.08 LED3.K | LED1.K 20,33.58 15.23,28.81 LED2.K
  Bottom 0.61: 15.28,25.03 LED2.K | 23.69,16.59 LED3.K
  Bottom 0.813: 15.28,25.03 SJ1.2 23.69,16.59
ML1
  Bottom 0.406: XH3.P$5 XH1.P$5
  Bottom 0.813: IC2.18 11.88,83.08 12.93,84.13 XH3.P$5
ML2
  Bottom 0.406: XH3.P$4 XH1.P$4
  Bottom 0.813: IC2.17 14.43,83.08 15.42,84.08 XH3.P$4
ML3
  Bottom 0.406: XH3.P$3 XH1.P$3
  Bottom 0.813: IC2.16 16.96,83.08 17.93,84.05 XH3.P$3
ML4
  Bottom 0.406: XH3.P$2 XH1.P$2
  Bottom 0.813: IC2.15 19.5,83.08 20.45,84.03 XH3.P$2
MR1
  Bottom 0.406: $1_83_$.P$5 XH2.P$5
  Bottom 0.61: XH2.P$5 27.2,86.36 IC2.14
MR2
  Bottom 0.61: IC2.13 24.58,81.32 26.8,83.53 27.97,83.53 29.99,85.55 $1_83_$.P$4 XH2.P$4
MR3
  Bottom 0.406: $1_83_$.P$3 XH2.P$3
  Bottom 0.61: XH2.P$3 33.05,84.85 32.46,84.27 30.19,84.27 IC2.12
MR4
  Bottom 0.406: $1_83_$.P$2 XH2.P$2
  Bottom 0.61: IC2.11 29.66,82.11 30.75,83.2 34.34,83.2 35.56,84.42 $1_83_$.P$2
N$1
  Bottom 0.254: 15.3,16.63 15.3,15.13
N$2
  Bottom 0.813: JP1.1 2.58,45 3,44.58 3.89,43.69 SG1.+
N$3
  Top 0.61: F1.1.2 F1.2
  Top 1.27: D2.C 48.2,31.28 42,25.08 42,16.58 39.5,14.08 39.5,7.08 41.5,5.08 43.75,5.08 44.7,4.13 S7.P$2
  Top 1.676: D2.C 48.2,34.43 D1.C 47.06,34.48 F1.2
N$4
  Top 0.61: LED2.1.A 17.02,25.83 LED2.A
  Top 0.813: R9.2 R9.1.2
  Bottom 0.61: 17.5,25.08 LED2.A 19.75,25.08 22,27.34 22,30.72 22.86,31.58 27.69,31.58 29.21,33.1 34.29,33.1 36.43,35.24 R9.2
N$5
  Top 0.61: LED1.1.A 25.52,34.33 LED1.A
  Top 0.813: R8.1.2 R8.2
  Bottom 0.61: R8.2 28.11,35.42 LED1.A
N$6
  Top 0.61: LED3.1.A 25.52,17.38 LED3.A
  Top 0.813: R10.1.2 R10.2
  Bottom 0.61: LED3.A 26.27,17.85 28,19.58 28,27.58 30,29.58 33.18,29.58 38.61,35 R10.2
N$8
  Top 0.61: LED4.1.A 34.02,25.83 LED4.A
  Top 0.813: R11.1.2 R11.1
  Bottom 0.61: R11.1 39.32,33.92 39.32,33.91 39.06,33.66 38.62,33.66 37.8,32.83 37.8,29.29 34.77,26.26 LED4.A
N$10
  Top 0.406: J2.P1 6.45,84.95 6.7,84.7 9.76,84.7
  Top 0.813: 9.76,84.7 11.06,84.7 11.45,84.32 37.68,84.32 40.64,81.36 41.51,80.48 47.58,80.48 48.41,79.66 48.41,70.08 47.27,68.94 D3.A
N$12
  Top 0.61: F1.1.1 F1.1
  Top 1.422: J1.1 45.96,46.06 46.09,45.92 X1.1.1
  Top 1.676: F1.1 44.72,44.55 46.09,45.92
N$15  (via drill 0.3)
  Top 0.61: RX.A v9.78,67.73 | v9.78,67.73 | R1.2 31.6,70.85 30.98,71.48 30.98,75.1 30.56,75.51 10.24,75.51 v9.95,75.22
  Bottom 0.61: v9.78,67.73 9.78,75.05 v9.95,75.22
N$16
  Top 0.406: IC4.3 37.93,52.16 37.54,52.55 35.56,52.55 34.92,51.9 34.92,51.89 34.85,51.82 31.35,51.82 R21.1 31.34,53.06 R20.2
N$17
  Top 0.305: Y1.1 26,65.38 25.4,65.98 IC3.7
N$18
  Top 0.305: IC3.8 25.2,66.78 25.8,67.38 Y1.3
N$19
  Top 0.406: 12.55,67.63 R13.2 12.65,67.58 12,67.58 11.4,66.98 LED1.3.A
N$20  (via drill 0.5, 0.6)
  Top 0.61: IC4.1 v35.93,50.25
  Top 1.422: L1.1 44.08,56.91 | 44.08,56.91 43.9,57.36 v42.64,55.08 | D4.A 44.11,57.05 44.08,56.91
  Bottom 1.422: v42.64,55.08 40.86,55.08 v35.93,50.25
N$21
  Top 0.813: D3.C F3.1
N$22
  Top 0.406: R22.2 39.57,48.72 40.25,48.05 RED.A
N$23
  Top 0.254: U1.9 34.64,66.48 R5.2
N$24
  Top 0.254: U1.8 36.6,66.98 37,66.58 37,65.58 36.57,65.15 35.61,65.15 34.43,63.96 33.79,63.96 R3.2
N$25
  Top 0.254: U1.6 36.46,67.98 36.73,68.25 36.73,68.89
  Top 0.406: 36.73,68.89 34.77,70.85 R1.1
RAW  (via drill 0.6)
  Top 0.61: IC4.5 IC4.4 40.39,53.67 C2.2
  Top 1.27: 42.4,52.64 42.33,52.64 v42.28,52.69 | F3.2 47.28,59.41 v47.3,59.39
  Top 1.422: C2.2 41.64,53.28 42.4,52.64 45.89,52.64 L1.2
  Bottom 0.61: 42.46,45.23 42.28,45.41
  Bottom 0.813: 42.46,45.23 42.41,45.18 42.41,40.85 42.55,40.72
  Bottom 1.27: S7.P$3 S7.P$1 41.55,2.53 41.55,4.69 39.24,6.99 39.24,13.92 41.91,16.59 41.91,33.1 43.18,34.37 46.35,34.37 47.62,35.64 47.62,38.81 46.99,39.45 43.74,39.45 43.74,39.53 42.55,40.72 | 42.28,45.41 v42.28,52.69 42.33,52.64 43.81,52.64 47.3,56.12 v47.3,59.39
RESET  (via drill 0.3)
  Top 0.305: v20.7,57.13 28.05,57.13 29.53,58.61 R7.2 29.58,60.5 29.58,61.05 30.9,62.36 C5.1
  Top 0.406: S6.2 22.35,54.28 20.7,55.93 v20.7,57.13 IC3.29
  Bottom 0.61: ICSP.5 7.91,67.17 7.92,67.18 8.6,67.18 9.6,66.18 9.6,63.83 16.3,57.13 v20.7,57.13
S1
  Top 0.813: R15.1.2 R15.2 | R19.1.1 R19.1 | S1.2 21.89,39.56 22.38,40.06 27.82,40.06 28.32,39.56 S1.1
  Bottom 0.813: R19.1 15.85,39.74 R15.2 15.91,39.68 16.95,39.68 17.09,39.54 18.85,39.54 S1.2
S2
  Top 0.813: R16.1.2 R16.2 | R15.1.1 R15.1
  Bottom 0.305: 10.54,31.38 S2.1
  Bottom 0.813: R16.2 10.54,17.95 S2.2 10.54,21.29 10.16,21.67 10.16,28.02 10.54,28.4 S2.1 | R15.1 13.35,32.08 12.65,31.38 10.54,31.38
S3
  Top 0.813: R16.1.1 R16.1 | R17.1.2 R17.2
  Bottom 0.813: R16.1 14.69,10.58 S3.1 21.66,10.61 22,10.26 27.94,10.24 28.28,10.58 S3.2 31.27,10.57 33.01,10.57 35.02,8.56 R17.2
S4
  Top 0.813: R18.1.1 R18.1
  Bottom 0.61: R18.1 38.69,16.28 39.48,17.07 39.48,18.82 S4.1 39.49,18.85 39.49,21.66 39.86,22.03 39.86,27.55 39.5,27.91 S4.2
S5
  Top 0.813: R18.1.2 R18.2 | R17.1.1 R17.1 | S5.1 28.31,22.57 27.94,22.94 22.1,22.95 21.73,22.58 S5.2
  Bottom 0.813: R18.2 37.35,11.77 R17.1 31.25,17.87 S5.1
TX3V3
  Top 0.813: R12.1.2 R12.2 | R13.1.2 R6.1 R12.2 | R12.2 J5.1
U3,3
  Top 0.254: C4.2 33.82,65.65 34.99,65.65 35.32,65.98 U1.10

### Text on the board
Top: CERN-OHL-W V2.0 | @escornabot
Bottom: 2042 | CPU 2.40.1 | CERN-OHL-W V2.0 | @escornabot | XDeSIG
tPlace: Motor Left | Motor Right | CPU 2.40 | TX RX G 5V | XDeSIG | L | RESET | Gn | A6 | 5V | Gn | 5V | SCL | SDA | Pseudo / Singularis | BUZ / On | ON | 4/6V | + | ON | CERN-OHL-W V2.0 | @escornabot
bPlace: Motor Left | Motor Right | 2042 | The basic Escornabot can be programmed / with the robot's buttons to execute / sequence of movements. From this, / the imagination is the only limit to / the possibilities. | Deseñado en Estrimia con agarimo | GND | OSHWA ES11 | + | XDeSIG | @escornabot | L-on | CERN-OHL-W V2.0
Measures: CERN Open Hardware Licence W V2.0
tDocu: CERN Open Hardware Licence 2.0